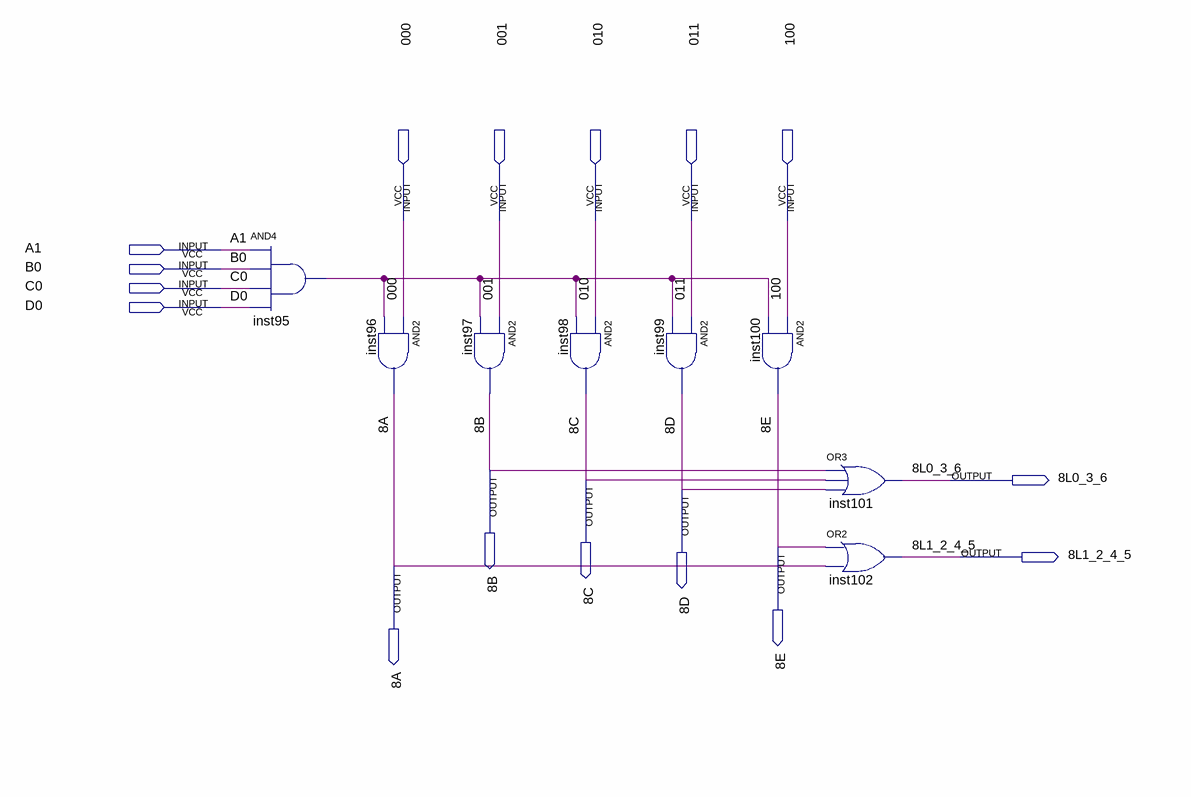
[diagram p0: schematic sheet]
// Quartus schematic carac8.bdf as structural Verilog: 8 symbols, 16 pins
module carac8 (
  input  \000 ,
  input  \001 ,
  input  \010 ,
  input  \011 ,
  input  \100 ,
  input  A1,
  input  B0,
  input  C0,
  input  D0,
  output \8B ,
  output \8C ,
  output \8L0_3_6 ,
  output \8D ,
  output \8E ,
  output \8L1_2_4_5 ,
  output \8A 
);

  wire inst95_out;

  and inst95 (inst95_out, A1, B0, C0, D0);
  and inst96 (\8A , \000 , inst95_out);
  and inst97 (\8B , \001 , inst95_out);
  and inst98 (\8C , \010 , inst95_out);
  and inst99 (\8D , \011 , inst95_out);
  and inst100 (\8E , \100 , inst95_out);
  or inst101 (\8L0_3_6 , \8B , \8C , \8D );
  or inst102 (\8L1_2_4_5 , \8E , \8A );
endmodule
